# Altium project IMX8SoCIot.PrjPcb (part 9 of 9)

## Sheet mPCIe_Slot.SchDoc
size 594 x 420 mm; SheetNumber: 20; SheetTotal: 20
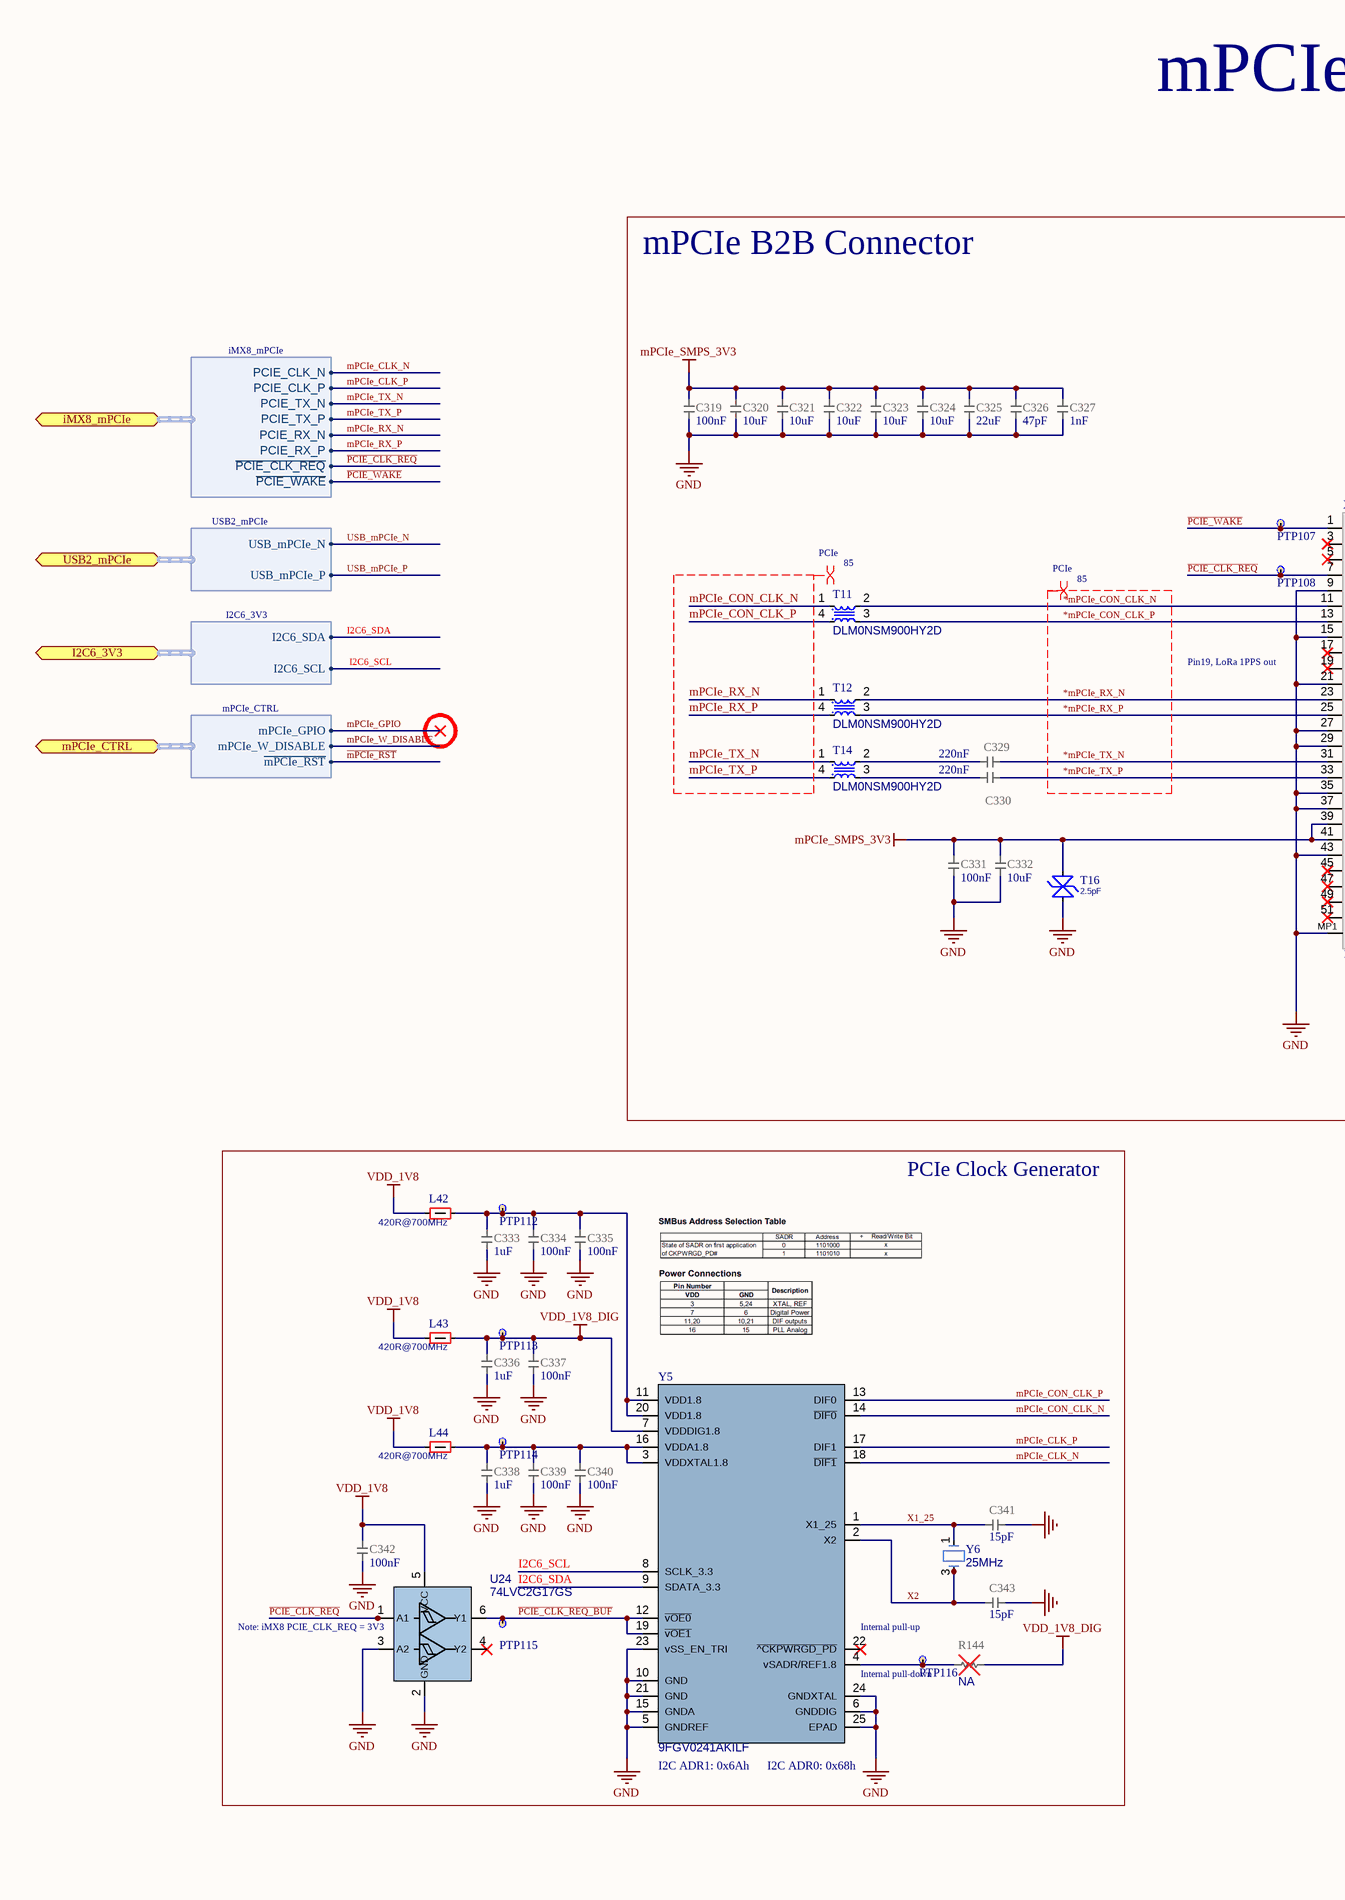
[diagram p33: mPCIe_Slot.SchDoc, left]
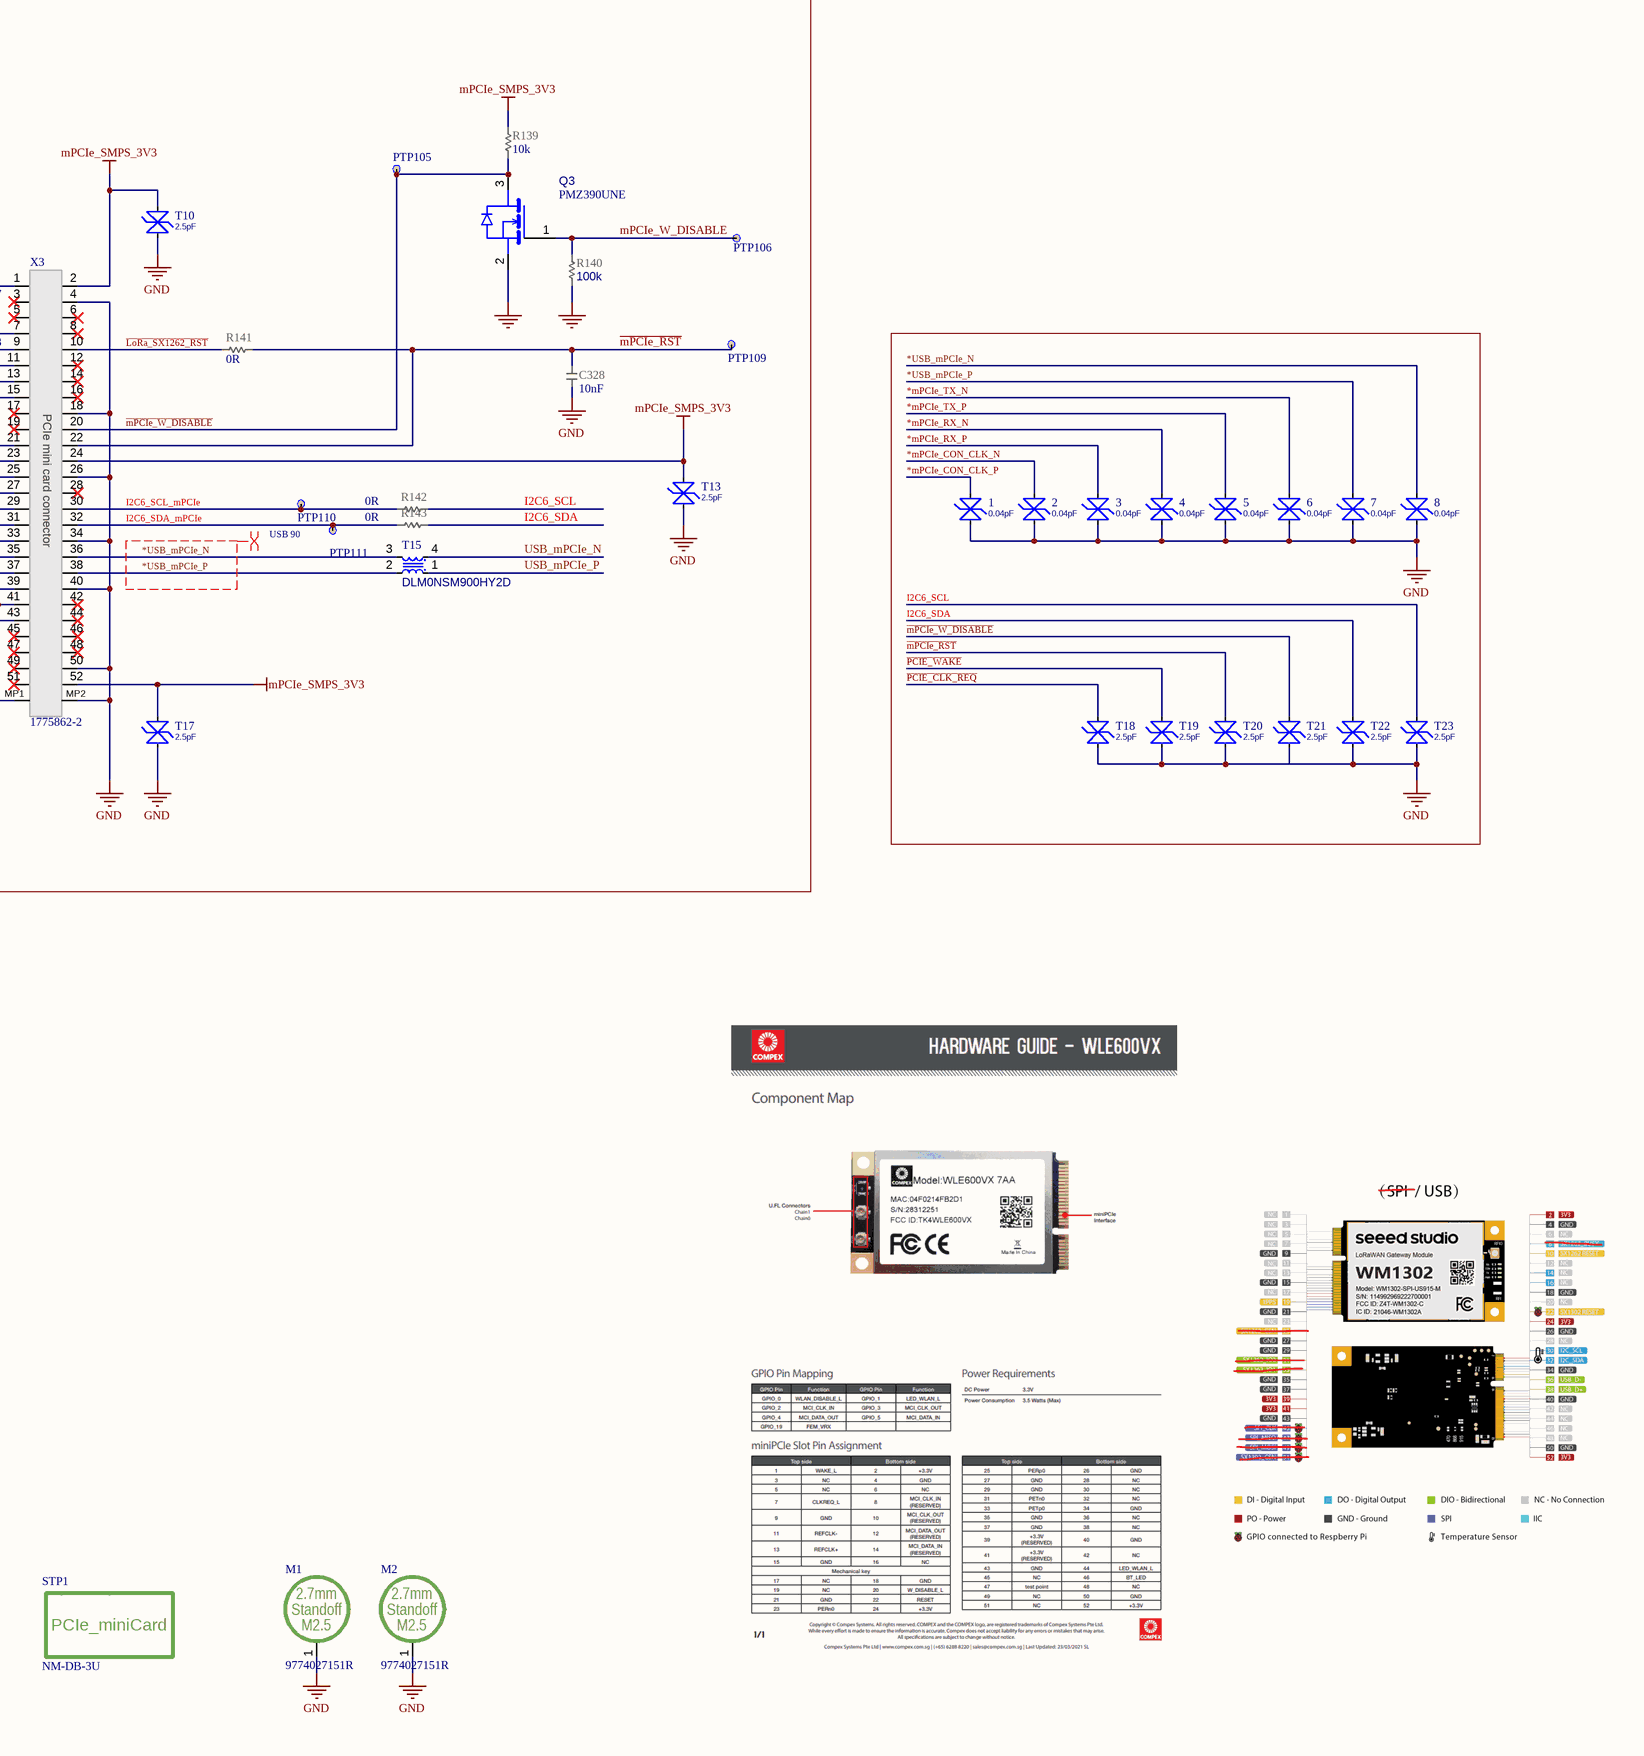
[diagram p34: mPCIe_Slot.SchDoc, right]

### Parts
1  value 0.04pF  [TVS_0201_EZAEG]  (hidden comment: TVS_0201_004_EZAEG1N)
2  value 0.04pF  [TVS_0201_EZAEG]  (hidden comment: TVS_0201_004_EZAEG1N)
3  value 0.04pF  [TVS_0201_EZAEG]  (hidden comment: TVS_0201_004_EZAEG1N)
4  value 0.04pF  [TVS_0201_EZAEG]  (hidden comment: TVS_0201_004_EZAEG1N)
5  value 0.04pF  [TVS_0201_EZAEG]  (hidden comment: TVS_0201_004_EZAEG1N)
6  value 0.04pF  [TVS_0201_EZAEG]  (hidden comment: TVS_0201_004_EZAEG1N)
7  value 0.04pF  [TVS_0201_EZAEG]  (hidden comment: TVS_0201_004_EZAEG1N)
8  value 0.04pF  [TVS_0201_EZAEG]  (hidden comment: TVS_0201_004_EZAEG1N)
C319  value 100nF  [CAP_0201_UN1Q]  (hidden comment: CAP_0201_100n_X7S_16V)
C320  value 10uF  [CAP_0402_H09W07_UN1Q]  (hidden comment: CAP_0402_10u_X6S)
C321  value 10uF  [CAP_0402_H09W07_UN1Q]  (hidden comment: CAP_0402_10u_X6S)
C322  value 10uF  [CAP_0402_H09W07_UN1Q]  (hidden comment: CAP_0402_10u_X6S)
C323  value 10uF  [CAP_0402_H09W07_UN1Q]  (hidden comment: CAP_0402_10u_X6S)
C324  value 10uF  [CAP_0402_H09W07_UN1Q]  (hidden comment: CAP_0402_10u_X6S)
C325  value 22uF  [CAP_0603_UN1Q]  (hidden comment: CAP_0603_22u_6.3V_X6S)
C326  value 47pF  [CAP_0201_UN1Q]  (hidden comment: CAP_0201_47p)
C327  value 1nF  [CAP_0201_UN1Q]  (hidden comment: CAP_0201_1n0)
C328  value 10nF  [CAP_0201_UN1Q]  (hidden comment: CAP_0201_10n_16V)
C329  value 220nF  [CAP_0201_UN1Q]  (hidden comment: CAP_0201_220n_10V_X6S)
C330  value 220nF  [CAP_0201_UN1Q]  (hidden comment: CAP_0201_220n_10V_X6S)
C331  value 100nF  [CAP_0201_UN1Q]  (hidden comment: CAP_0201_100n_X7S_16V)
C332  value 10uF  [CAP_0402_H09W07_UN1Q]  (hidden comment: CAP_0402_10u_X6S)
C333  value 1uF  [CAP_0201_UN1Q]  (hidden comment: CAP_0201_1uF_X6S)
C334  value 100nF  [CAP_0201_UN1Q]  (hidden comment: CAP_0201_100n_X7S_16V)
C335  value 100nF  [CAP_0201_UN1Q]  (hidden comment: CAP_0201_100n_X7S_16V)
C336  value 1uF  [CAP_0201_UN1Q]  (hidden comment: CAP_0201_1uF_X6S)
C337  value 100nF  [CAP_0201_UN1Q]  (hidden comment: CAP_0201_100n_X7S_16V)
C338  value 1uF  [CAP_0201_UN1Q]  (hidden comment: CAP_0201_1uF_X6S)
C339  value 100nF  [CAP_0201_UN1Q]  (hidden comment: CAP_0201_100n_X7S_16V)
C340  value 100nF  [CAP_0201_UN1Q]  (hidden comment: CAP_0201_100n_X7S_16V)
C341  value 15pF  [CAP_0201_UN1Q]  (hidden comment: CAP_0201_15p)
C342  value 100nF  [CAP_0201_UN1Q]  (hidden comment: CAP_0201_100n_X7S_16V)
C343  value 15pF  [CAP_0201_UN1Q]  (hidden comment: CAP_0201_15p)
L42  value 420R@700MHz  [IND_0201_UN1Q]  (hidden comment: FERRITE_0201_BLF_700MHz_420Ohm)
L43  value 420R@700MHz  [IND_0201_UN1Q]  (hidden comment: FERRITE_0201_BLF_700MHz_420Ohm)
L44  value 420R@700MHz  [IND_0201_UN1Q]  (hidden comment: FERRITE_0201_BLF_700MHz_420Ohm)
M1  Part Number: 9774027151R  [Standoff_2_7mm_M25_WURTH]  (hidden comment: Standoff_2_7mm_M25_WURTH)
M2  Part Number: 9774027151R  [Standoff_2_7mm_M25_WURTH]  (hidden comment: Standoff_2_7mm_M25_WURTH)
PTP105  PTP_0.4mm  [PTP_0.4mm]  (value not drawn)  (no BOM)
PTP106  PTP_0.4mm  [PTP_0.4mm]  (value not drawn)  (no BOM)
PTP107  PTP_0.4mm  [PTP_0.4mm]  (value not drawn)  (no BOM)
PTP108  PTP_0.4mm  [PTP_0.4mm]  (value not drawn)  (no BOM)
PTP109  PTP_0.4mm  [PTP_0.4mm]  (value not drawn)  (no BOM)
PTP110  PTP_0.4mm  [PTP_0.4mm]  (value not drawn)  (no BOM)
PTP111  PTP_0.4mm  [PTP_0.4mm]  (value not drawn)  (no BOM)
PTP112  PTP_0.4mm  [PTP_0.4mm]  (value not drawn)  (no BOM)
PTP113  PTP_0.4mm  [PTP_0.4mm]  (value not drawn)  (no BOM)
PTP114  PTP_0.4mm  [PTP_0.4mm]  (value not drawn)  (no BOM)
PTP115  PTP_0.4mm  [PTP_0.4mm]  (value not drawn)  (no BOM)
PTP116  PTP_0.4mm  [PTP_0.4mm]  (value not drawn)  (no BOM)
Q3  PMZ390UNE  [SOT883_DFN1006-3_NEXPERIA]
R139  value 10k  [RES_0201_UN1Q]  (hidden comment: RES_0201_10k)
R140  value 100k  [RES_0201_UN1Q]  (hidden comment: RES_0201_100k)
R141  value 0R  [RES_0201_UN1Q]  (hidden comment: RES_0201_0R)
R142  value 0R  [RES_0201_UN1Q]  (hidden comment: RES_0201_0R)
R143  value 0R  [RES_0201_UN1Q]  (hidden comment: RES_0201_0R)
R144  value NA  [RES_0201_UN1Q]  (hidden comment: RES_0201_NA)
STP1  Part Number: NM-DB-3U  [PCIe_miniCard]  (hidden comment: PCIe_miniCard)  (no BOM)
T10  value 2.5pF  [TVS_0201_EZAEG]  (hidden comment: TVS_0201_2.5pF_5V)
T11  Part Number: DLM0NSM900HY2D  [DLM0NSxxxxHY2_Murata]  (hidden comment: EMI_Filter_DLM0NSM900HY2)
T12  Part Number: DLM0NSM900HY2D  [DLM0NSxxxxHY2_Murata]  (hidden comment: EMI_Filter_DLM0NSM900HY2)
T13  value 2.5pF  [TVS_0201_EZAEG]  (hidden comment: TVS_0201_2.5pF_5V)
T14  Part Number: DLM0NSM900HY2D  [DLM0NSxxxxHY2_Murata]  (hidden comment: EMI_Filter_DLM0NSM900HY2)
T15  Part Number: DLM0NSM900HY2D  [DLM0NSxxxxHY2_Murata]  (hidden comment: EMI_Filter_DLM0NSM900HY2)
T16  value 2.5pF  [TVS_0201_EZAEG]  (hidden comment: TVS_0201_2.5pF_5V)
T17  value 2.5pF  [TVS_0201_EZAEG]  (hidden comment: TVS_0201_2.5pF_5V)
T18  value 2.5pF  [TVS_0201_EZAEG]  (hidden comment: TVS_0201_2.5pF_5V)
T19  value 2.5pF  [TVS_0201_EZAEG]  (hidden comment: TVS_0201_2.5pF_5V)
T20  value 2.5pF  [TVS_0201_EZAEG]  (hidden comment: TVS_0201_2.5pF_5V)
T21  value 2.5pF  [TVS_0201_EZAEG]  (hidden comment: TVS_0201_2.5pF_5V)
T22  value 2.5pF  [TVS_0201_EZAEG]  (hidden comment: TVS_0201_2.5pF_5V)
T23  value 2.5pF  [TVS_0201_EZAEG]  (hidden comment: TVS_0201_2.5pF_5V)
U24  74LVC2G17GS  [XSON6_SOT1202_Nexperia]
X3  Part Number: 1775862-2  [mPCIe_TE_1775862-2]  (hidden comment: 1775862-2_TE)
Y5  9FGV0241AKILF  [VFQFPN-24_9FGV0241AKLF]
Y6  value 25MHz  [XTAL_2016_UN1Q]  (hidden comment: XTAL_25M_ECS_2016_4-SMD)

### Blocks framed on the sheet
mPCIe B2B Connector: C319-C332 PTP105-PTP111 Q3 R139-R143 T10-T17 X3
PCIe Clock Generator: C333-C343 L42-L44 PTP112-PTP116 R144 U24 Y5 Y6

### Ports
I2C6_3V3 (bidir, harness I2C6_3V3), iMX8_mPCIe (bidir, harness iMX8_mPCIe), mPCIe_CTRL (bidir, harness mPCIe_CTRL), USB2_mPCIe (bidir, harness USB2_mPCIe)

### Harnesses
iMX8_mPCIe: PCIE_CLK_N, PCIE_CLK_P, PCIE_TX_N, PCIE_TX_P, PCIE_RX_N, PCIE_RX_P, ~{PCIE_CLK_REQ}, ~{PCIE_WAKE}
mPCIe_CTRL: mPCIe_GPIO, ~{mPCIe_RST}, mPCIe_W_DISABLE
USB2_mPCIe: USB_mPCIe_N, USB_mPCIe_P
I2C6_3V3: I2C6_SDA, I2C6_SCL

### Nets
GND: 1.1 2.1 3.1 4.1 5.1 6.1 7.1 8.1 C319.2 C320.1 C321.1 C322.1 C323.1 C324.1 C325.1 C326.1 C327.2 C328.1 C331.1 C332.2 C333.1 C334.1 C335.1 C336.1 C337.1 C338.1 C339.1 C340.1 C341.2 C342.1 C343.1 M1.1 M2.1 Q3.2(S) R140.1 T10.1 T13.1 T16.1 T17.1 T18.1 T19.1 T20.1 T21.1 T22.1 T23.1 U24.2(GND) U24.3(A2) X3.4 X3.9 X3.15 X3.18 X3.21 X3.26 X3.27 X3.29 X3.34 X3.35 X3.37 X3.40 X3.43 X3.50 X3.MP1 X3.MP2 Y5.5(GNDREF) Y5.6(GNDDIG) Y5.10(GND) Y5.15(GNDA) Y5.21(GND) Y5.23(vSS_EN_TRI) Y5.24(GNDXTAL) Y5.25(EPAD) Y6.2(GND) Y6.4(GND)
mPCIe_SMPS_3V3: C319.1 C320.2 C321.2 C322.2 C323.2 C324.2 C325.2 C326.2 C327.1 C331.2 C332.1 R139.2 T10.2 T13.2 T16.2 T17.2 X3.2 X3.24 X3.39 X3.41 X3.52
VDD_1V8: C342.2 L42.1 L43.1 L44.1 U24.5(VCC)
VDD_1V8_DIG: C336.2 C337.2 L43.2 PTP113.1(TP) R144.2 Y5.7(VDDDIG1.8)
*mPCIe_CON_CLK_N: 2.2 T11.2 X3.11
*mPCIe_CON_CLK_P: 1.2 T11.3 X3.13
*mPCIe_RX_N: 4.2 T12.2 X3.23
*mPCIe_RX_P: 3.2 T12.3 X3.25
*mPCIe_TX_N: 6.2 C329.2 X3.31
*mPCIe_TX_P: 5.2 C330.2 X3.33
*USB_mPCIe_N: 8.2 T15.3 X3.36
*USB_mPCIe_P: 7.2 T15.2 X3.38
~{LoRa_SX1262_RST}: R141.1 X3.10
~{mPCIe_RST}: C328.2 PTP109.1(TP) R141.2 T20.2 X3.22 ; port mPCIe_CTRL.~{mPCIe_RST}
~{mPCIe_W_DISABLE}: PTP105.1(TP) Q3.3(D) R139.1 T21.2 X3.20
~{PCIE_CLK_REQ}: PTP108.1(TP) T18.2 U24.1(A1) X3.7 ; port iMX8_mPCIe.~{PCIE_CLK_REQ}
~{PCIE_CLK_REQ_BUF}: PTP115.1(TP) U24.6(Y1) Y5.12(~{vOE0}) Y5.19(~{vOE1})
~{PCIE_WAKE}: PTP107.1(TP) T19.2 X3.1 ; port iMX8_mPCIe.~{PCIE_WAKE}
I2C6_SCL: R142.2 T23.2 Y5.8(SCLK_3.3) ; port I2C6_3V3.I2C6_SCL
I2C6_SCL_mPCIe: PTP110.1(TP) R142.1 X3.30
I2C6_SDA: R143.2 T22.2 Y5.9(SDATA_3.3) ; port I2C6_3V3.I2C6_SDA
I2C6_SDA_mPCIe: PTP111.1(TP) R143.1 X3.32
mPCIe_CLK_N: Y5.18(~{DIF1}) ; port iMX8_mPCIe.PCIE_CLK_N
mPCIe_CLK_P: Y5.17(DIF1) ; port iMX8_mPCIe.PCIE_CLK_P
mPCIe_CON_CLK_N: T11.1 Y5.14(~{DIF0})
mPCIe_CON_CLK_P: T11.4 Y5.13(DIF0)
mPCIe_RX_N: T12.1 ; port iMX8_mPCIe.PCIE_RX_N
mPCIe_RX_P: T12.4 ; port iMX8_mPCIe.PCIE_RX_P
mPCIe_TX_N: T14.1 ; port iMX8_mPCIe.PCIE_TX_N
mPCIe_TX_P: T14.4 ; port iMX8_mPCIe.PCIE_TX_P
mPCIe_W_DISABLE: PTP106.1(TP) Q3.1(G) R140.2 ; port mPCIe_CTRL.mPCIe_W_DISABLE  [project net ECSPI1_MOSI]
USB_mPCIe_N: T15.4 ; port USB2_mPCIe.USB_mPCIe_N
USB_mPCIe_P: T15.1 ; port USB2_mPCIe.USB_mPCIe_P
X1_25: C341.1 Y5.1(X1_25) Y6.1
X2: C343.2 Y5.2(X2) Y6.3
NetC329_1: C329.1 T14.2
NetC330_1: C330.1 T14.3
NetC333_2: C333.2 C334.2 C335.2 L42.2 PTP112.1(TP) Y5.11(VDD1.8) Y5.20(VDD1.8)
NetC338_2: C338.2 C339.2 C340.2 L44.2 PTP114.1(TP) Y5.3(VDDXTAL1.8) Y5.16(VDDA1.8)
NetPTP116_1: PTP116.1(TP) R144.1 Y5.4(vSADR/REF1.8)

Not connected (* = marked no-connect by the designer): U24 4(Y2)*; X3 3* 5* 6* 8* 12* 14* 16* 17* 19* 28* 42* 44* 45* 46* 47* 48* 49* 51*; Y5 22(~{^CKPWRGD_PD})*

### Layout directives
differential pair; differential pair class 90; net class USB; rule Matched Net Lengths [Tolerance = 0.3mm]: *USB_mPCIe_N, *USB_mPCIe_P
differential pair; net class PCIe; rule Matched Net Lengths [Tolerance = 0.1mm]; differential pair class 85: *mPCIe_CON_CLK_N, *mPCIe_CON_CLK_P, *mPCIe_RX_N, *mPCIe_RX_P, *mPCIe_TX_N, *mPCIe_TX_P, mPCIe_CON_CLK_N, mPCIe_CON_CLK_P, mPCIe_RX_N, mPCIe_RX_P, mPCIe_TX_N, mPCIe_TX_P

### Notes on the sheet
- mPCIe SLOT
- Pin19, LoRa 1PPS out
- (near U24) Note: iMX8 PCIE_CLK_REQ = 3V3
- Internal pull-up
- Internal pull-down
- (near Y5) I2C ADR1: 0x6Ah
- (near Y5) I2C ADR0: 0x68h
- DWG NO:
- REV:
- THIS DOCUMENT AND THE DATA DISCLOSED HEREIN OR
- HEREWITH IS THE PROPERTY OF ALTIUM LIMITED AND MAY
- BE FREELY DISTRIBUTED IN WHOLE. NO RIGHTS ARE
- RESERVED OR EXPRESS OR IMPLIED WARANTEE GIVEN.
- REVISION
- DESCRIPTION
- DATE
- APPROVED
- ENG:
- APPROVALS
- PROJECT
- DSN:
- CHK:
- REFERENCE DOCUMENTS
- PROJECT REVISION:
- TITLE
- DOCUMENT REVISION:
- DESIGN ITEM:
- BOM:
- FAB DWG:
- PCB DWG:
- ASSY DWG:
- SCALE:
- A2
- SIZE
- CAGE CODE
- FILE NAME
- DWG NO.
- SHEET
- OF
- REV
- (in symbol CMP-001-001437-1) PCIe mini card connector
- (in symbol CMP-012-000004-10) 2.7mm; M2.5

### Library data of the parts
1-8 = CMP-001-000774-6: ESD Protection Panasonic EZAEG1N50AC; Voltage: 30V; Sort order: 402; HasBeenBuilt: False; System: Discrete; Part Number: EZAEG1N50AC; Package: 0201; Manufacturer: Panasonic; Operating temperature range: -55C ... +125C; Dimensions WxLxH: 0.33 mm x 0.63mm x 0.26mm; ComponentLink1Description: 1_Datasheet; ComponentLink1URL: https://industrial.panasonic.com/ww/products/pt/esd-suppressor/models/EZAEG1N50AC; ComponentLink2Description: 2_Product page; ComponentLink3Description: 3_X-information; ComponentLink4Description: 4_X-information; Creation date: 17102023; ClassName: SMALL; Source: Discrete_UN1Q.SchLib; Manufacturer Part Number: EZAEG1N50AC; Component Type: ESD & EMI
C319 C331 C334 C335 C337 C339 C340 C342 = CMP-001-000385-16: CAP; Part Number: GRM033C71C104KE14D; Manufacturer: Murata; Temperature characteristics: X7S; Tolerance: +/-10%; Sort order: 302; HasBeenBuilt: TBD; Alternative component: Allowed; Voltage: 16V; System: RLC; Package: 0201; ClassName: SMALL; ComponentLink1Description: 1_Datasheet; ComponentLink2Description: 2_Product page; ComponentLink3Description: 3_X-information; ComponentLink4Description: 4_X-information; Creation date: 20190101; Source: RLC_UN1Q.SchLib; Manufacturer Part Number: GRM033C71C104KE14D; Component Type: Capacitor
C320-C324 C332 = CMP-001-000883-14: CAP; Part Number: GMC04X6S106M6R3NT; Manufacturer: Cal-Chip Electronics, Inc.; Manufacturer: Cal-Chip Electronics; Temperature characteristics: X6S; Voltage: 6.3V; Tolerance: +/-20%; Sort order: 304; HasBeenBuilt: TBD; Alternative component: Allowed; System: RLC; Package: 0402; ComponentLink1Description: 1_Datasheet; ComponentLink2Description: 2_Product page; ComponentLink3Description: 3_X-information; ComponentLink4Description: 4_X-information; Creation date: 26042024; Manufacturer Part Number: GMC04X6S106M6R3NT; Component Type: Capacitor
C325 = CMP-001-000890-13: CAP; Part Number: GRM188C80J226ME15D; Manufacturer: Murata; Temperature characteristics: X6S; Tolerance: +/-20%; Sort order: 306; HasBeenBuilt: TBD; Alternative component: Allowed; Voltage: 6.3V; System: RLC; Package: 0603; ComponentLink1Description: 1_Datasheet; ComponentLink2Description: 2_Product page; ComponentLink3Description: 3_X-information; ComponentLink4Description: 4_X-information; Creation date: 26042024; Manufacturer Part Number: GRM188C80J226ME15D; Component Type: Capacitor
C326 = CMP-001-000292-14: CAP; Part Number: GRM0335C1H470JA01D; Manufacturer: Samsung; Manufacturer: Murata; Temperature characteristics: C0G; Voltage: 50V; Tolerance: +/-5%; Sort order: 302; HasBeenBuilt: TBD; Alternative component: Allowed; System: RLC; Package: 0201; ClassName: SMALL; ComponentLink1Description: 1_Datasheet; ComponentLink2Description: 2_Product page; ComponentLink3Description: 3_X-information; ComponentLink4Description: 4_X-information; Creation date: 20190101; Source: RLC_UN1Q.SchLib; Manufacturer Part Number: GRM0335C1H470JA01D; Component Type: Capacitor
C327 = CMP-001-000271-14: CAP; Part Number: GRM033R71E102KA01D; Manufacturer: Samsung; Manufacturer: Murata; Temperature characteristics: X7R; Tolerance: +/-10%; Sort order: 302; HasBeenBuilt: TBD; Alternative component: Allowed; Voltage: 25V; System: RLC; Package: 0201; ComponentLink1Description: 1_Datasheet; ComponentLink2Description: 2_Product page; ComponentLink3Description: 3_X-information; ComponentLink4Description: 4_X-information; Creation date: 20190101; ClassName: SMALL; Manufacturer Part Number: GRM033R71E102KA01D; Component Type: Capacitor
C328 = CMP-001-000335-15: CAP; Part Number: GRM033R71C103KE14D; Manufacturer: Murata; Temperature characteristics: X7R; Tolerance: +/-10%; Sort order: 302; HasBeenBuilt: TBD; Alternative component: Allowed; Voltage: 16V; System: RLC; Package: 0201; ClassName: SMALL; ComponentLink1Description: 1_Datasheet; ComponentLink2Description: 2_Product page; ComponentLink3Description: 3_X-information; ComponentLink4Description: 4_X-information; Creation date: 20190101; Source: RLC_UN1Q.SchLib; Manufacturer Part Number: GRM033R71C103KE14D; Component Type: Capacitor
C329 C330 = CMP-001-000889-11: CAP; Part Number: GRM033C81A224KE01D; Manufacturer: Murata; Temperature characteristics: X6S; Voltage: 10V; Tolerance: +/-20%; Sort order: 302; HasBeenBuilt: TBD; Alternative component: Allowed; System: RLC; Package: 0201; Dimensions WxLxH: 0.35; ComponentLink1Description: 1_Datasheet; ComponentLink2Description: 2_Product page; ComponentLink3Description: 3_X-information; ComponentLink4Description: 4_X-information; Creation date: 26042024; ClassName: SMALL; Manufacturer Part Number: GRM033C81A224KE01D; Component Type: Capacitor
C333 C336 C338 = CMP-001-000336-15: CAP; Part Number: KGM03CS61A105MH; Manufacturer: Kyocera; Manufacturer: KYOCERA AVX; Temperature characteristics: X6S; Voltage: 10V; Tolerance: +/-20%; Sort order: 302; HasBeenBuilt: False; Alternative component: Allowed; System: RLC; Package: 0201; Operating temperature range: -55C to +105C; ClassName: SMALL; ComponentLink1Description: 1_Datasheet; ComponentLink2Description: 2_Product page; ComponentLink3Description: 3_X-information; ComponentLink4Description: 4_X-information; Creation date: 20190101; Source: RLC_UN1Q.SchLib; Manufacturer Part Number: KGM03CS61A105MH; Component Type: Capacitor
C341 C343 = CMP-001-000269-15: CAP; Part Number: GRM0335C1H150JA01D; Manufacturer: Murata; Temperature characteristics: C0G; Voltage: 50V; Tolerance: +/-5%; Sort order: 302; HasBeenBuilt: TBD; Alternative component: Allowed; System: RLC; Package: 0201; ComponentLink1Description: 1_Datasheet; ComponentLink2Description: 2_Product page; ComponentLink3Description: 3_X-information; ComponentLink4Description: 4_X-information; Creation date: 20190101; ClassName: SMALL; Source: RLC_UN1Q.SchLib; Manufacturer Part Number: GRM0335C1H150JA01D; Component Type: Capacitor
L42-L44 = CMP-001-000747-7: FERRITE; Part Number: BLF03JD421GZE; Manufacturer: Murata; HasBeenBuilt: False; System: Discrete; Sort order: 362; Tolerance: 25%; ComponentLink3Description: 3_X-information; Creation date: 20200304; ClassName: SMALL; ComponentLink1Description: 1_Datasheet; ComponentLink2Description: 2_Product page; Package: 0201; ComponentLink4Description: 4_X-information; Source: Discrete_UN1Q.SchLib; Operating temperature range: -55 ... +125C; Manufacturer Part Number: BLF03JD421GZE; Component Type: Ferrite
M1 M2 = CMP-012-000004-10: Standoff 2.7 mm M2.5 Hole 3.7 mm; Manufacturer: WURTH; Manufacturer: Wurth Elektronik; Sort order: 101; HasBeenBuilt: Saluki3; ComponentLink1Description: 1_Datasheet; ComponentLink1URL: https://www.we-online.com/components/products/datasheet/9774027151R.pdf; Creation date: 20230621; Dimensions WxLxH: M2.5 5.1x4.0mm; ComponentLink2Description: 2_Product page; ComponentLink2URL: https://www.we-online.com/catalog/en/SMSI_SMT_STEEL_SPACER_M2_5_THREAD_INTERNAL; ComponentLink3Description: 3_X-information; ComponentLink4Description: 4_X-information; System: Standoff; ECCN: EAR99; Source: EMECH_UN1Q.SchLib; Design Item ID: Standoff_2_7mm_M25_WURTH; RoHS: RoHS3 with ex; Manufacturer Part Number: 9774027151R; Component Type: Standoff
PTP105 = CMP-001-001296-3: Production Testpoint 0.4mm. Flying probe. Use 1mm pitch.; ComponentLink4Description: 4_X-information; ComponentLink1Description: 1_Datasheet; Part Number: PTP 0.4mm; Sort order: -; ClassName: SMALL; System: Test Point; HasBeenBuilt: -; Design Item ID: PTP_0.4mm; ComponentLink3Description: 3_X-information; Creation date: 20240909; ComponentLink2Description: 2_Product page
PTP106-PTP116 = CMP-001-001296-3: Production Testpoint 0.4mm. Flying probe. Use 1mm pitch.; Part Number: PTP 0.4mm; ComponentLink4Description: 4_X-information; ComponentLink1Description: 1_Datasheet; Sort order: -; ClassName: SMALL; System: Test Point; HasBeenBuilt: -; Design Item ID: PTP_0.4mm; ComponentLink3Description: 3_X-information; Creation date: 20240909; ComponentLink2Description: 2_Product page; Component Type: Test Point
Q3 = CMP-031-000024-4: NMOS Transistor, 30V; Manufacturer: Nexperia; Sort order: 447; HasBeenBuilt: CCB30_1; System: Discrete; Part Number: PMZ390UNE; ComponentLink1Description: 1_Datasheet; ComponentLink1URL: https://assets.nexperia.com/documents/data-sheet/PMZ390UNE.pdf; ComponentLink2Description: 2_Product page; ComponentLink3Description: 3_X-information; ComponentLink4Description: 4_X-information; Creation date: 20230913; Dimensions WxLxH: 1.0 × 0.6 × 0.48 mm; Operating temperature range: -55 ... +150 °C; Package: DFN1006-3(SOT883); ClassName: SMALL; Source: UUDET_KOMPONENTIT.SchLib; Manufacturer Part Number: PMZ390UNE; Component Type: Transistor
R139 = CMP-001-000446-13: RES; Part Number: RC0201FR-0710KL; Manufacturer: YAGEO; Power Rating: 1/20W; Sort order: 322; HasBeenBuilt: TBD; Tolerance: 1%; Alternative component: Allowed; System: RLC; Package: 0201; ClassName: SMALL; ComponentLink1Description: 1_Datasheet; ComponentLink2Description: 2_Product page; ComponentLink3Description: 3_X-information; ComponentLink4Description: 4_X-information; Creation date: 20190101; Source: RLC_UN1Q.SchLib; Component Type: Resistor
R140 = CMP-001-000526-11: RES; Part Number: RC0201FR-07100KL; Manufacturer: YAGEO; Tolerance: 1%; Power Rating: 1/20W; Sort order: 322; HasBeenBuilt: TBD; Alternative component: Allowed; System: RLC; Package: 0201; ClassName: SMALL; ComponentLink1Description: 1_Datasheet; ComponentLink2Description: 2_Product page; ComponentLink3Description: 3_X-information; ComponentLink4Description: 4_X-information; Creation date: 20190101; Source: RLC_UN1Q.SchLib; Component Type: Resistor
R141 = CMP-001-000429-13: RES; Part Number: RC0201JR-070RL; Manufacturer: YAGEO; HasBeenBuilt: TBD; Sort order: 322; System: RLC; Alternative component: Allowed; Tolerance: 5%; Power Rating: 1/20W; Creation date: 20190101; Source: RLC_UN1Q.SchLib; ComponentLink4Description: 4_X-information; ComponentLink2Description: 2_Product page; ClassName: SMALL; ComponentLink3Description: 3_X-information; Package: 0201; ComponentLink1Description: 1_Datasheet
R142 R143 = CMP-001-000429-13: RES; Part Number: RC0201JR-070RL; Manufacturer: YAGEO; Tolerance: 5%; Power Rating: 1/20W; Sort order: 322; HasBeenBuilt: TBD; Alternative component: Allowed; System: RLC; Package: 0201; ClassName: SMALL; ComponentLink1Description: 1_Datasheet; ComponentLink2Description: 2_Product page; ComponentLink3Description: 3_X-information; ComponentLink4Description: 4_X-information; Creation date: 20190101; Source: RLC_UN1Q.SchLib; Component Type: Resistor
R144 = CMP-001-000434-10: Not Assembled - RES; Sort order: 999; HasBeenBuilt: TBD; System: RLC; Package: 0201; ClassName: SMALL; ComponentLink1Description: 1_Datasheet; ComponentLink2Description: 2_Product page; ComponentLink3Description: 3_X-information; ComponentLink4Description: 4_X-information; Creation date: 20190101; Source: RLC_UN1Q.SchLib; Component Type: Resistor
STP1 = CMP-014-000007-4: Manufacturer: Doodle Labs; Sort order: 999; Remark: STEP; System: EMECH; ComponentLink1Description: 1_Datasheet; ComponentLink1URL: https://doodlelabs.com/wp-content/uploads/Doodle-Labs-NM-DB-3-Data-Sheet.pdf; ComponentLink2Description: 2_Product page; ComponentLink3Description: 3_X-information; ComponentLink4Description: 4_X-information; Design Item ID: PCIe_miniCard; Source: EMECH_UN1Q.SchLib; ClassName: STEP; Component Type: STEP Model
T10 T13 T16-T23 = CMP-001-001100-1: ESD Protection  TVS Diodes SMP Diode 0201 5vdc 2.5pf <12v clamp@1a; Part Number: GG0201052R542P; Manufacturer: KYOCERA AVX; Voltage: 5.0V; Sort order: 402; System: Discrete; Package: 0201; Operating temperature range: -55 ... +125C; ComponentLink1Description: 1_Datasheet; ComponentLink1URL: https://datasheets.kyocera-avx.com/AVX-GiGuard.pdf; ComponentLink2Description: 2_Product page; ComponentLink3Description: 3_X-information; ComponentLink4Description: 4_X-information; Creation date: 20250310; ClassName: SMALL; Manufacturer: Kyocera AVX; Manufacturer Part Number: GG0201052R542P; Component Type: ESD & EMI
T11 T12 T14 T15 = CMP-001-000968-3: EMI Filter 90Ω 100MHz 100mA 5V; Manufacturer: Murata; Sort order: 441; HasBeenBuilt: Cmod2_01; System: Discrete; Package: 0.85x0.65x0.50; Operating temperature range: -40 ... +85 °C; Dimensions WxLxH: 0.85x0.65x0.50; ComponentLink1Description: 1_Datasheet; ComponentLink1URL: https://www.murata.com/en-us/api/pdfdownloadapi?cate=cgsubChipCommoModeChokeCoil&partno=DLM0NSM900HY2%23; ComponentLink2Description: 2_Product page; ComponentLink2URL: https://www.murata.com/products/productdetail?partno=DLM0NSM900HY2%23; ComponentLink3Description: 3_X-information; ComponentLink4Description: 4_X-information; Creation date: 20230103; Source: UUDET_KOMPONENTIT.SchLib; Manufacturer Part Number: DLM0NSM900HY2D; Component Type: ESD & EMI
U24 = CMP-001-001197-8: Non-inverting, Schmitt-Trigger, CMOS.; Manufacturer: Nexperia; Manufacturer Part Number: 74LVC2G17GS,132; Sort order: 446; System: IC; ComponentLink1Description: 1_Datasheet; ComponentLink1URL: https://assets.nexperia.com/documents/data-sheet/74LVC2G17.pdf; ComponentLink2Description: 2_Product page; ComponentLink2URL: https://www.nexperia.com/search?q=74LVC2G&searchCategory=product; ComponentLink3Description: 3_X-information; ComponentLink4Description: 4_X-information; Creation date: 06032024; Dimensions WxLxH: 1.0 mm x 1.0 mm x 0.35mm; Operating temperature range: -40C ... +125C; Package: XSON6; Part Number: 74LVC2G17GS; Component Type: Logic
X3 = CMP-001-001437-1: TE PCIe connector, 52 pins, height 4 mm; Manufacturer: TE Connectivity; Sort order: 111; ClassName: BIG; ComponentLink1Description: 1_Datasheet; ComponentLink1URL: https://www.te.com/commerce/DocumentDelivery/DDEController?Action=srchrtrv&DocNm=8-1773459-7_EXPRESS_MINI_CARD_QRG&DocType=Data%20Sheet&DocLang=English&DocFormat=pdf&PartCntxt=1775862-2; ComponentLink2Description: 2_Product page; ComponentLink2URL: https://www.te.com/en/product-1775862-2.html; ComponentLink3Description: 3_X-information; ComponentLink4Description: 4_X-information; Creation date: 20250617; Dimensions WxLxH: 5.56 x 29.9 x 5.2mm; Manufacturer: TE; Operating temperature range: -55 ... +85 C; System: Connector; ECCN: EAR99; RoHS: RoHS 2; Manufacturer Part Number: 1775862-2; Component Type: Interface Connector
Y5 = CMP-001-001278-2: PCIe Clock Generator, 2-output PCIE GEN 1–4 CLOCK GENERATOR; Manufacturer: Renesas Electronics Corporation; Manufacturer: Renesas; Sort order: 455; System: IC; ECCN: EAR99; ComponentLink3Description: 3_X-information; ComponentLink4Description: 4_X-information; Operating temperature range: -40 .... +85 °C; ComponentLink1URL: https://www.renesas.com/us/en/document/dst/9fgv0241-datasheet; Creation date: 20240816; Part Number: 9FGV0241AKILF; Dimensions WxLxH: 4.0x4.0x0.9mm; ComponentLink1Description: 1_Datasheet; Design Item ID: 9FGV0241AKILF; Package: VFQFPN-24; ComponentLink2Description: 2_Product page; ClassName: BIG; Manufacturer Part Number: 9FGV0241AKILF; Component Type: Timing
Y6 = CMP-001-000909-8: Crystal 25MHz ±10ppm, 10pF; Part Number: ECS-250-10-37B-CTN; Manufacturer: ECS Inc.; Manufacturer: ECS International; Manufacturer Part Number: ECS-250-10-37B-CTN-TR; Tolerance: +/-10ppm; Sort order: 455; HasBeenBuilt: Cmod2_01; System: Discrete; Operating temperature range: -40 ... +85C; Dimensions WxLxH: 2 x 1.6mm x 0.65mm; Creation date: 20230102; ComponentLink1Description: 1_Datasheet; ComponentLink1URL: https://ecsxtal.com/store/pdf/ECX-1637B.pdf; ComponentLink2Description: 2_Product_page; ComponentLink2URL: https://ecsxtal.com/products/crystals/surface-mount-crystals/ecx-1637b/; ComponentLink3Description: 3_X-information; ComponentLink4Description: 4_X-information; ECCN: EAR99; Source: UUDET_KOMPONENTIT.SchLib; RoHS: RoHS3; Component Type: Crystal & Oscillator

## Nets that join several sheets
1V8_PER: SMPS (C191.2 L18.2 PTP69.1), USB_PER1 (L26.1 R107.2 R108.2 R109.2), USB_PER2 (L28.1 R116.2 R117.2 R118.2), IO_EXPANDER (6 pins)
3V3_SMPS: SMPS (C165.2 L13.2 PTP56.1), USB_HUB (C232.2 L23.1), ETHERNET (6 pins), SYSTEM_INTERFACE (L41.2)
5V0_SMPS: SMPS (C148.2 L10.2 PTP47.1), IMX8_PMIC (L2.1), SYSTEM_INTERFACE (J20.11 J22.11)
5V0_SMPS_RBC: SMPS (C180.2 L16.2 PTP63.1), IMX8_DISPLAY (L1.1), USB_HUB (R100.1 R101.1), USB_PER1 (C247.1 R102.1 R110.2 U14.12), USB_PER2 (C259.1 R111.1 U17.12)
GND: SMPS (108 pins), IMX8_INTERFACE (10 pins), IMX8_DISPLAY (16 pins), IMX8_eMMC (34 pins), IMX8_IO (8 pins), IMX8_LPDDR4 (86 pins), IMX8_PHY (R18#2.1 R19#2.1 R20.1), IMX8_PMIC (36 pins), IMX8_PWR (165 pins), USB_HUB (37 pins), USB_PER1 (28 pins), USB_PER2 (28 pins), IO_EXPANDER (14 pins), ETHERNET (40 pins), SYSTEM_INTERFACE (50 pins), mPCIe_Slot (73 pins)
mPCIe_SMPS_3V3: SMPS (C198.2 L19.2 PTP72.1), mPCIe_Slot (21 pins)
NVCC_DRAM_1V1: IMX8_LPDDR4 (64 pins), IMX8_PMIC (5 pins), IMX8_PWR (10 pins)
NVCC_SD2: IMX8_eMMC (R30.1 R35.1 R40.2), IMX8_PMIC (C124.2 PTP35.1 U6.55), IMX8_PWR (C11.2 U1.W24)
NVCC_SNVS_1V8: IMX8_INTERFACE (C221.1 R86.2 U10.1), IMX8_IO (R1#2.1 R2#2.1 R3.1), IMX8_PMIC (C112#2.1 PTP27#2.1 R45.1 U6.3), IMX8_PWR (C1#2.2 U1.R24)
VDD_1V8: IMX8_INTERFACE (R87.1 R88.1 R89.1 R90.1), IMX8_eMMC (17 pins), IMX8_LPDDR4 (14 pins), IMX8_PMIC (6 pins), IMX8_PWR (9 pins), SYSTEM_INTERFACE (J20.13 J22.13), mPCIe_Slot (5 pins)
VDD_3V3: IMX8_INTERFACE (13 pins), IMX8_DISPLAY (5 pins), IMX8_eMMC (7 pins), IMX8_PMIC (7 pins), IMX8_PWR (8 pins), IO_EXPANDER (C263.2 L30.1 L31.1 U19.8), SYSTEM_INTERFACE (J20.1 J22.1 L40.2)
VDD_ARM: IMX8_PMIC (6 pins), IMX8_PWR (26 pins)
VDD_SOC: IMX8_PMIC (9 pins), IMX8_PWR (63 pins)
VDDA_1V8: IMX8_PMIC (C119#2.1 PTP31.1 U6.54), IMX8_PWR (24 pins)
VSD_3V3: IMX8_eMMC (5 pins), IMX8_PMIC (C138.1 PTP42.1 U6.23)
*LAN1_TXRXA_N: ETHERNET (C280.2), SYSTEM_INTERFACE (J21.11)
*LAN1_TXRXA_P: ETHERNET (C277.2), SYSTEM_INTERFACE (J21.10)
*LAN1_TXRXB_N: ETHERNET (C282.2), SYSTEM_INTERFACE (J21.4)
*LAN1_TXRXB_P: ETHERNET (C281.2), SYSTEM_INTERFACE (J21.5)
*LAN1_TXRXC_N: ETHERNET (C284.2), SYSTEM_INTERFACE (J21.3)
*LAN1_TXRXC_P: ETHERNET (C283.2), SYSTEM_INTERFACE (J21.2)
*LAN1_TXRXD_N: ETHERNET (C286.2), SYSTEM_INTERFACE (J21.8)
*LAN1_TXRXD_P: ETHERNET (C285.2), SYSTEM_INTERFACE (J21.9)
*LAN2_TXRXA_N: ETHERNET (C303.2), SYSTEM_INTERFACE (T9.7)
*LAN2_TXRXA_P: ETHERNET (C300.2), SYSTEM_INTERFACE (T9.6)
*LAN2_TXRXB_N: ETHERNET (C305.2), SYSTEM_INTERFACE (T8.7)
*LAN2_TXRXB_P: ETHERNET (C304.2), SYSTEM_INTERFACE (T8.6)
*LAN2_TXRXC_N: ETHERNET (C307.2), SYSTEM_INTERFACE (T9.10)
*LAN2_TXRXC_P: ETHERNET (C306.2), SYSTEM_INTERFACE (T9.9)
*LAN2_TXRXD_N: ETHERNET (C309.2), SYSTEM_INTERFACE (T8.10)
*LAN2_TXRXD_P: ETHERNET (C308.2), SYSTEM_INTERFACE (T8.9)
~{ENET1_INT}: IMX8_PHY (U1.AF10), ETHERNET (U21.31)
~{ENET1_RST}: IMX8_PHY (U1.AC10), ETHERNET (U21.12)
~{ENET2_INT}: IMX8_PHY (U1.AH17), ETHERNET (U22.31)
~{ENET2_RST}: IMX8_PHY (U1.AJ16), ETHERNET (U22.12)
~{GPIO_EXP_INT}: IMX8_IO (U1.E8), IO_EXPANDER (PTP98.1 U20.A3), SYSTEM_INTERFACE (J20.4)
~{I_LIMIT_PER1}: USB_PER1 (U12.1), IO_EXPANDER (U18.D2)
~{I_LIMIT_PER2}: USB_PER2 (PTP92.1 U15.1), IO_EXPANDER (U18.C4)
~{mPCIe_RST}: IMX8_IO (U1.AF20), mPCIe_Slot (5 pins)
~{PCIE_CLK_REQ}: IMX8_INTERFACE (R81.1), IMX8_IO (U1.AF8), SYSTEM_INTERFACE (J22.37), mPCIe_Slot (PTP108.1 T18.2 U24.1 X3.7)
~{PCIE_WAKE}: IMX8_INTERFACE (R80.1), IMX8_IO (U1.AD8), SYSTEM_INTERFACE (J22.39), mPCIe_Slot (PTP107.1 T19.2 X3.1)
~{PER1_INT}: USB_PER1 (R109.1 U14.6), IO_EXPANDER (U18.C3)
~{PER2_INT}: USB_PER2 (R118.1 U17.6), IO_EXPANDER (U18.E4)
~{USB_HUB_RST}: IMX8_IO (U1.AE20), USB_HUB (U11#2.26)
ADJ_mPCIe_PWR: SMPS (PTP78.1 Q1.1 R70.2), IO_EXPANDER (PTP100.1 U20.D4)
BOOT_MODE0: IMX8_INTERFACE (R94.2 S2.1), IMX8_IO (U1.G10)
BOOT_MODE1: IMX8_INTERFACE (R93.2 S2.2), IMX8_IO (U1.F8)
BOOT_MODE2: IMX8_INTERFACE (R92.2 S2.3), IMX8_IO (U1.G8)
BOOT_MODE3: IMX8_INTERFACE (R91.2 S2.4), IMX8_IO (U1.G12)
ECSPI1_MOSI: IMX8_IO (U1.AC20), mPCIe_Slot (PTP106.1 Q3.1 R140.2)
ECSPI2_MISO: IMX8_IO (U1.AH20), SYSTEM_INTERFACE (J22.36)
ECSPI2_MOSI: IMX8_IO (U1.AJ21), SYSTEM_INTERFACE (J22.34)
ECSPI2_SCLK: IMX8_IO (U1.AH21), SYSTEM_INTERFACE (J22.38)
EN_mPCIe_PWR: SMPS (U9.2 U9.10), IO_EXPANDER (PTP99.1 R128.2 U20.E5)
EN_SMPS_RBC: SMPS (U8.2), IO_EXPANDER (PTP101.1 R127.2 U20.C5)
ENET1_MDC: IMX8_PHY (U1.AH9), ETHERNET (U21.13)
ENET1_MDIO: IMX8_PHY (U1.AJ8), ETHERNET (U21.14)
ENET1_RD0: IMX8_PHY (U1.AD10), ETHERNET (U21.25)
ENET1_RD1: IMX8_PHY (U1.AE10), ETHERNET (U21.24)
ENET1_RD2: IMX8_PHY (U1.AH10), ETHERNET (U21.23)
ENET1_RD3: IMX8_PHY (U1.AH12), ETHERNET (U21.22)
ENET1_RX_CTL: IMX8_PHY (U1.AF12), ETHERNET (U21.26)
ENET1_RXC: IMX8_PHY (U1.AJ12), ETHERNET (U21.27)
ENET1_TD0: IMX8_PHY (U1.AJ11), ETHERNET (U21.18)
ENET1_TD1: IMX8_PHY (U1.AJ10), ETHERNET (U21.17)
ENET1_TD2: IMX8_PHY (U1.AH11), ETHERNET (U21.16)
ENET1_TD3: IMX8_PHY (U1.AD12), ETHERNET (U21.15)
ENET1_TX_CTL: IMX8_PHY (U1.AH13), ETHERNET (U21.19)
ENET1_TXC: IMX8_PHY (U1.AH14), ETHERNET (U21.20)
ENET2_MDC: IMX8_PHY (U1.AH28), ETHERNET (U22.13)
ENET2_MDIO: IMX8_PHY (U1.AH29), ETHERNET (U22.14)
ENET2_RD0: IMX8_PHY (U1.AG29), ETHERNET (U22.25)
ENET2_RD1: IMX8_PHY (U1.AG28), ETHERNET (U22.24)
ENET2_RD2: IMX8_PHY (U1.AF29), ETHERNET (U22.23)
ENET2_RD3: IMX8_PHY (U1.AF28), ETHERNET (U22.22)
ENET2_RX_CTL: IMX8_PHY (U1.AE28), ETHERNET (U22.26)
ENET2_RXC: IMX8_PHY (U1.AE29), ETHERNET (U22.27)
ENET2_TD0: IMX8_PHY (U1.AC25), ETHERNET (U22.18)
ENET2_TD1: IMX8_PHY (U1.AE26), ETHERNET (U22.17)
ENET2_TD2: IMX8_PHY (U1.AF26), ETHERNET (U22.16)
ENET2_TD3: IMX8_PHY (U1.AD24), ETHERNET (U22.15)
ENET2_TX_CTL: IMX8_PHY (U1.AF24), ETHERNET (U22.19)
ENET2_TXC: IMX8_PHY (U1.AE24), ETHERNET (U22.20)
GPIO1_IO00: IMX8_IO (U1.A7), IO_EXPANDER (U18.A3), SYSTEM_INTERFACE (J20.2)
GPIO1_IO05: IMX8_IO (U1.B4), SYSTEM_INTERFACE (J20.6)
GPIO1_IO06: IMX8_IO (U1.A3), SYSTEM_INTERFACE (J20.8)
GPIO1_IO07: IMX8_IO (U1.F6), SYSTEM_INTERFACE (J20.10)
GPIO1_IO08: IMX8_IO (U1.A8), SYSTEM_INTERFACE (J20.12)
GPIO1_IO09: IMX8_IO (U1.B8), SYSTEM_INTERFACE (J20.14)
GPIO1_IO10: IMX8_IO (U1.B7), SYSTEM_INTERFACE (J20.16)
GPIO1_IO11: IMX8_IO (U1.D8), SYSTEM_INTERFACE (J20.18)
GPIO1_IO12: IMX8_IO (U1.A5), SYSTEM_INTERFACE (J20.20)
GPIO1_IO13: IMX8_IO (U1.A6), SYSTEM_INTERFACE (J20.22)
GPIO1_IO14: IMX8_IO (U1.A4), SYSTEM_INTERFACE (J20.24)
GPIO1_IO15: IMX8_IO (U1.B5), SYSTEM_INTERFACE (J20.26)
I2C1_SCL: IMX8_INTERFACE (R75.1), IMX8_IO (U1.AC8), IMX8_PMIC (U6.41), SYSTEM_INTERFACE (J22.25)
I2C1_SDA: IMX8_INTERFACE (R74.1), IMX8_IO (U1.AH7), IMX8_PMIC (U6.42), SYSTEM_INTERFACE (J22.27)
I2C2_SCL: IMX8_INTERFACE (R77.1), IMX8_IO (U1.AH6), SYSTEM_INTERFACE (J22.29 U23.10)
I2C2_SDA: IMX8_INTERFACE (R76.1), IMX8_IO (U1.AE8), SYSTEM_INTERFACE (J22.31 U23.9)
I2C3_SCL: IMX8_INTERFACE (R79.1), IMX8_IO (U1.AJ7), SYSTEM_INTERFACE (J22.33)
I2C3_SDA: IMX8_INTERFACE (R78.1), IMX8_IO (U1.AJ6), SYSTEM_INTERFACE (J22.35)
I2C5_SCL: IMX8_INTERFACE (R83.1), IMX8_PHY (U1.AE18), IO_EXPANDER (U20.A5), SYSTEM_INTERFACE (N1.2)
I2C5_SDA: IMX8_INTERFACE (R82.1), IMX8_PHY (U1.AC18), IO_EXPANDER (U20.A4), SYSTEM_INTERFACE (N1.4)
I2C6_SCL: IMX8_INTERFACE (R84.2 R85.1), IMX8_PHY (U1.AC14), IO_EXPANDER (U18.A5 U19.7), mPCIe_Slot (R142.2 T23.2 Y5.8)
I2C6_SDA: IMX8_INTERFACE (R84.1), IMX8_PHY (U1.AD14), IO_EXPANDER (U18.A4 U19.6), mPCIe_Slot (R143.2 T22.2 Y5.9)
IO_P0_1: IO_EXPANDER (R125.2 U20.C3), SYSTEM_INTERFACE (J22.4)
IO_P0_2: IO_EXPANDER (U20.B1), SYSTEM_INTERFACE (J22.6)
IO_P1_0: IO_EXPANDER (R126.2 U20.E3), SYSTEM_INTERFACE (J22.8)
IO_P1_1: IO_EXPANDER (U20.E4), SYSTEM_INTERFACE (J22.10)
IO_P1_2: IO_EXPANDER (U20.D3), SYSTEM_INTERFACE (J22.12)
mPCIe_CLK_N: IMX8_PHY (U1.E16), mPCIe_Slot (Y5.18)
mPCIe_CLK_P: IMX8_PHY (U1.D16), mPCIe_Slot (Y5.17)
mPCIe_RX_N: IMX8_PHY (U1.B14), mPCIe_Slot (T12.1)
mPCIe_RX_P: IMX8_PHY (U1.A14), mPCIe_Slot (T12.4)
mPCIe_TX_N: IMX8_PHY (U1.B15), mPCIe_Slot (T14.1)
mPCIe_TX_P: IMX8_PHY (U1.A15), mPCIe_Slot (T14.4)
ONOFF: IMX8_INTERFACE (PTP87.1 S1.8), IMX8_IO (R3.2 U1.G22)
PER1_CH1_SET1: USB_PER1 (U13.1), IO_EXPANDER (U18.C1)
PER1_CH1_SET2: USB_PER1 (U13.4), IO_EXPANDER (U18.C2)
PER1_CH2_SET1: USB_PER1 (U13.13), IO_EXPANDER (U18.D1)
PER1_CH2_SET2: USB_PER1 (U13.10), IO_EXPANDER (U18.E1)
PER1_ID: USB_PER1 (R108.1 U14.9), IO_EXPANDER (U18.B1)
PER1_PWR_EN: USB_PER1 (R105.2 U12.7), IO_EXPANDER (U18.A1)
PER2_CH1_SET1: USB_PER2 (U16.1), IO_EXPANDER (U18.E5)
PER2_CH1_SET2: USB_PER2 (U16.4), IO_EXPANDER (U18.D4)
PER2_CH2_SET1: USB_PER2 (U16.13), IO_EXPANDER (U18.D5)
PER2_CH2_SET2: USB_PER2 (U16.10), IO_EXPANDER (U18.C5)
PER2_ID: USB_PER2 (R117.1 U17.9), IO_EXPANDER (U18.D3)
PER2_PWR_EN: USB_PER2 (PTP93.1 R114.2 U15.7), IO_EXPANDER (U18.E3)
PER_I2C_SCL: USB_PER1 (U14.8), USB_PER2 (U17.8), IO_EXPANDER (R122.1 U19.2)
PER_I2C_SDA: USB_PER1 (U14.7), USB_PER2 (U17.7), IO_EXPANDER (R121.1 U19.3)
PGOOD_mPCIe: SMPS (PTP79.1 R68.1 U9.1), IO_EXPANDER (U20.D5)
PGOOD_RBC_1V8: SMPS (PTP68.1 R58.1 U8.12), IO_EXPANDER (Q2.2 U20.D2)
PMIC_nINT: IMX8_IO (U1.D6), IMX8_PMIC (U6.13)
PMIC_ON_REQ: IMX8_IO (R1#2.2 U1.F22), IMX8_PMIC (U6.39)
PMIC_STBY_REQ: IMX8_IO (U1.J24), IMX8_PMIC (U6.40)
POR_B: IMX8_INTERFACE (U10.3), IMX8_IO (R2#2.2 U1.J29), IMX8_PMIC (U6.9)
POR_B_3V3: IMX8_INTERFACE (U10.4), IMX8_DISPLAY (U3.4 U3.11), IO_EXPANDER (Q2.4 R120.2), SYSTEM_INTERFACE (R138.2)
SD2_RESET_B: IMX8_eMMC (PTP40#1.1 R40.1 U1.AD28), IMX8_PMIC (U6.12)
SD2_VSEL: IMX8_IO (U1.E6), IMX8_PMIC (U6.29)
SYS_nRST: IMX8_INTERFACE (PTP88.1 S1.7), IMX8_PMIC (R45.2 U6.8)
TPM_ENA: IO_EXPANDER (U20.A1), SYSTEM_INTERFACE (J22.2 PTP103.1 R138.1 U23.11)
UART1_RXD: IMX8_IO (U1.AD6), SYSTEM_INTERFACE (J20.15)
UART1_TXD: IMX8_IO (U1.AJ3), SYSTEM_INTERFACE (J20.17)
UART2_RXD: IMX8_IO (U1.AF6), SYSTEM_INTERFACE (J20.29)
UART2_TXD: IMX8_IO (U1.AH4), SYSTEM_INTERFACE (J20.31)
UART3_RXD: IMX8_IO (U1.AE6), SYSTEM_INTERFACE (J20.33)
UART3_TXD: IMX8_IO (U1.AJ4), SYSTEM_INTERFACE (J20.35)
UART4_RXD: IMX8_IO (U1.AJ5), SYSTEM_INTERFACE (J20.37)
UART4_TXD: IMX8_IO (U1.AH5), SYSTEM_INTERFACE (J20.39)
USB1_D_N: IMX8_PHY (U1.E10), USB_PER1 (D4.2 J9.A7 J9.B7 J12.1)
USB1_D_P: IMX8_PHY (U1.D10), USB_PER1 (D4.1 J9.A6 J9.B6 J11.1)
USB1_RX_N: IMX8_PHY (U1.B9), USB_PER1 (U13.17)
USB1_RX_P: IMX8_PHY (U1.A9), USB_PER1 (U13.18)
USB1_TX_N: IMX8_PHY (C83.1), USB_PER1 (U13.14)
USB1_TX_P: IMX8_PHY (C84.1), USB_PER1 (U13.15)
USB2_D_N: USB_HUB (U11#2.8), USB_PER2 (D7.2 J15.A7 J15.B7 J17.1)
USB2_D_P: USB_HUB (U11#2.9), USB_PER2 (D7.1 J15.A6 J15.B6 J16.1)
USB2_HUB_UP_N: IMX8_PHY (U1.E14), USB_HUB (U11#2.30)
USB2_HUB_UP_P: IMX8_PHY (U1.D14), USB_HUB (U11#2.31)
USB2_RX_N: IMX8_PHY (U1.B12), USB_PER2 (U16.17)
USB2_RX_P: IMX8_PHY (U1.A12), USB_PER2 (U16.18)
USB2_TX_N: IMX8_PHY (C85.1), USB_PER2 (U16.14)
USB2_TX_P: IMX8_PHY (C86.1), USB_PER2 (U16.15)
USB_mPCIe_N: USB_HUB (U11#2.1), mPCIe_Slot (T15.4)
USB_mPCIe_P: USB_HUB (U11#2.2), mPCIe_Slot (T15.1)
WDOG_B: IMX8_IO (U1.B6), IMX8_PMIC (PTP43.1 R46.2 U6.28)